# EAGLE design SwiftV2 (EAGLE 6.1)
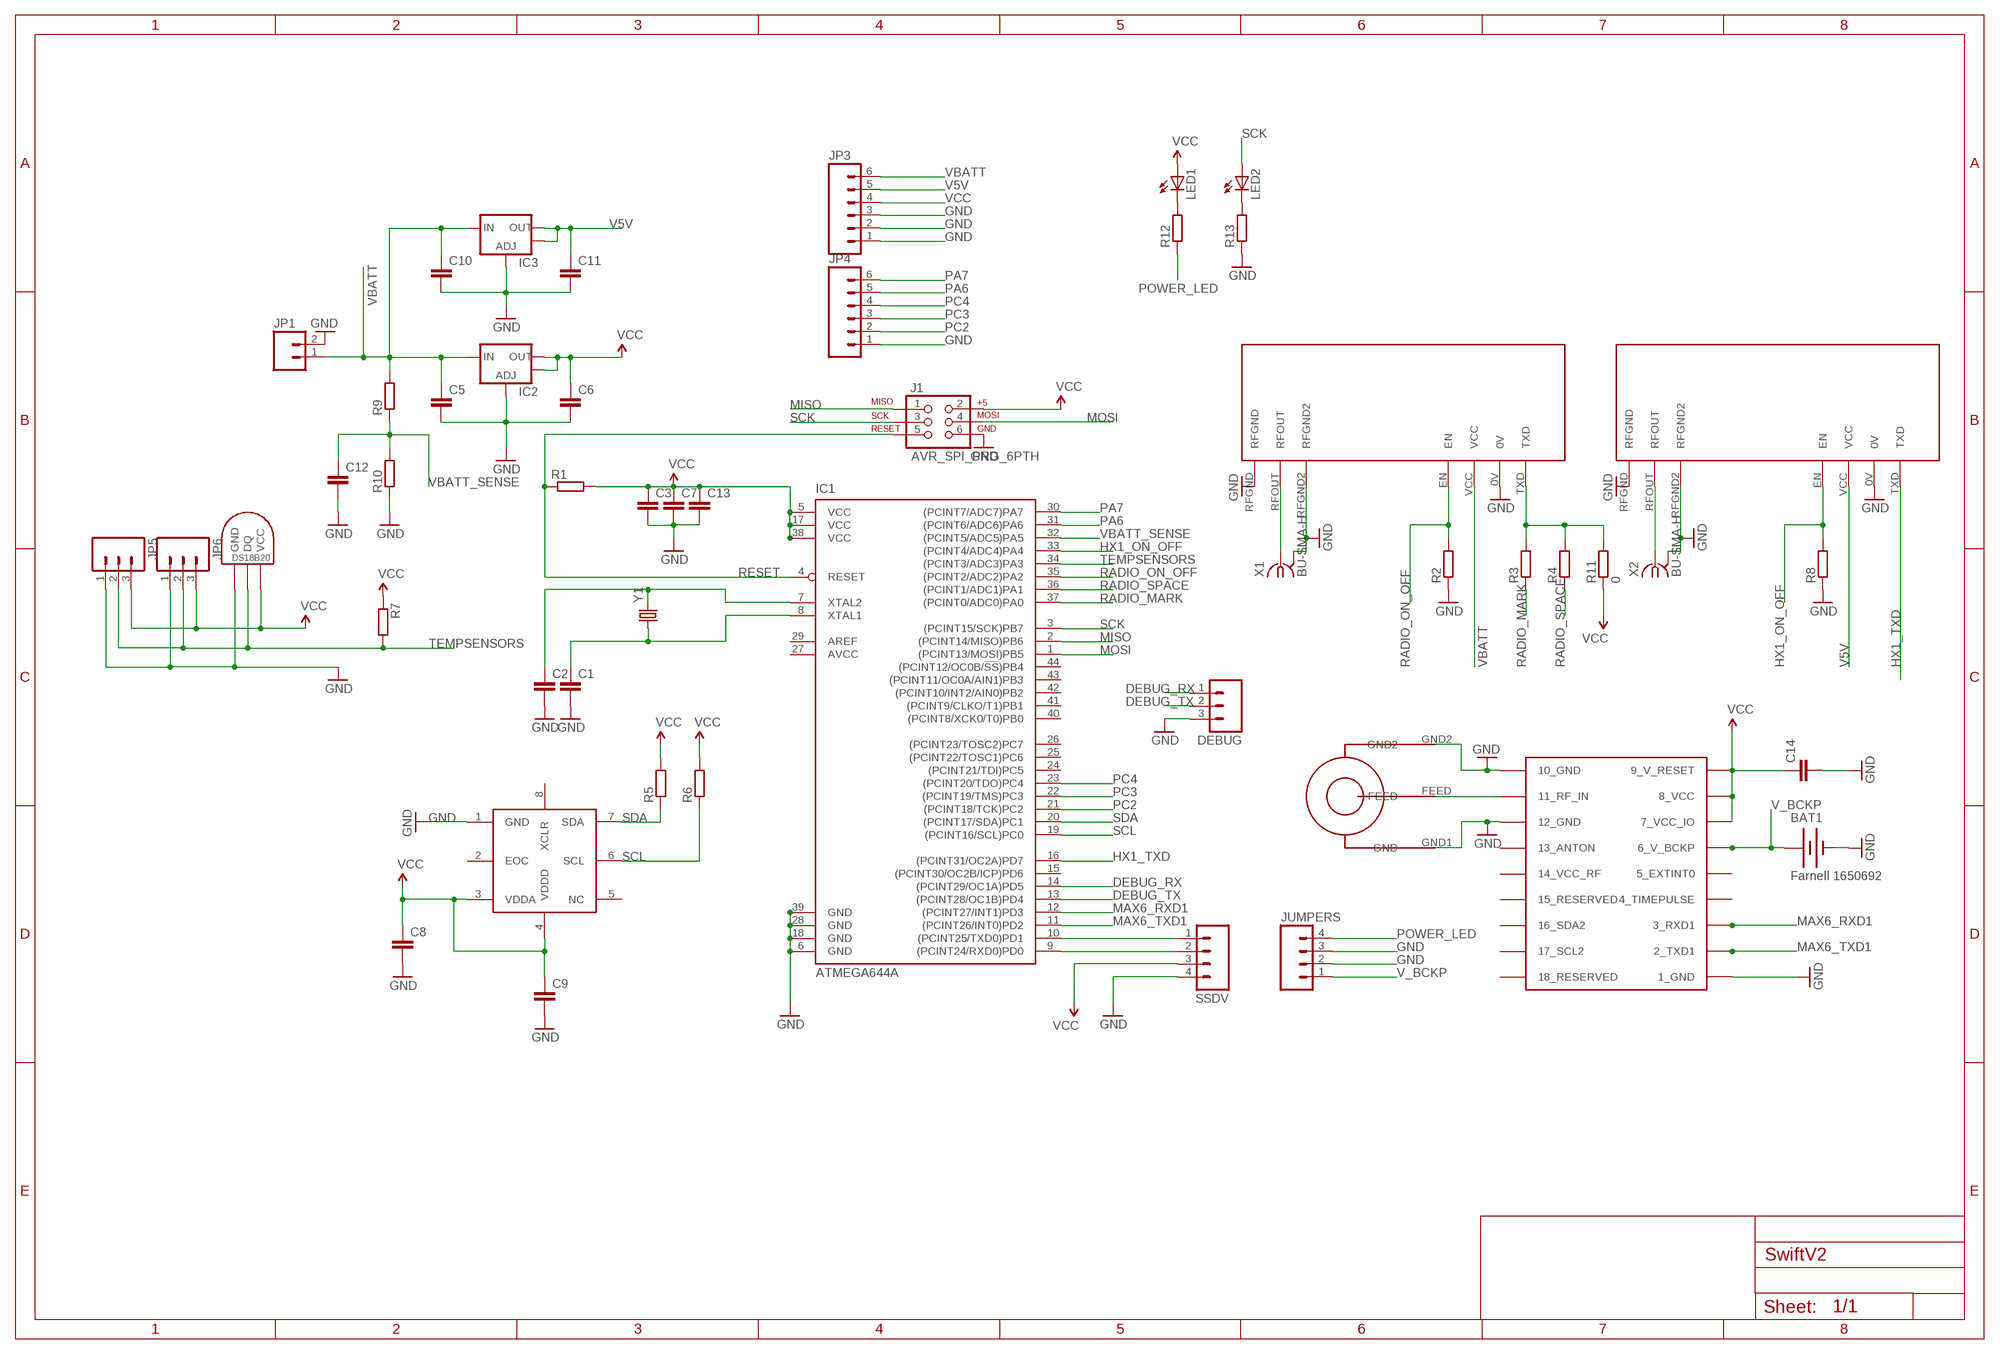
[diagram p0: schematic, sheet 1]

## Parts
BAT1  Farnell 1650692  BATTERY12MM  [BATTCON_12MM]
C1  C-EUC0805  [C0805]
C2  C-EUC0805  [C0805]
C3  C-EUC0805  [C0805]
C5  C-EUC0805  [C0805]
C6  C-EUC0805  [C0805]
C7  C-EUC0805  [C0805]
C8  C-EUC0805  [C0805]
C9  C-EUC0805  [C0805]
C10  C-EUC0805  [C0805]
C11  C-EUC0805  [C0805]
C12  C-EUC0805  [C0805]
C13  C-EUC0805  [C0805]
C14  C-EUC0805  [C0805]
DEBUG  M03PTH  [1X03]
IC1  ATMEGA644A  [TQFP44]
IC2  V_REG_LM1117SOT223  [SOT223]
IC3  V_REG_LM1117SOT223  [SOT223]
J1  AVR_SPI_PRG_6PTH  [2X3]
JP1  M02JST-PTH-2  [JST-2-PTH]
JP3  M06SIP  [1X06]
JP4  M06SIP  [1X06]
JP5  M03JST-PTH  [JST-3-PTH]
JP6  M03JST-PTH  [JST-3-PTH]
JUMPERS  M04PTH  [1X04]
LED1  LED0603  [LED-0603]
LED2  LED0603  [LED-0603]
R1  R-EU_R0805  [R0805]
R2  R-EU_R0805  [R0805]
R3  R-EU_R0805  [R0805]
R4  R-EU_R0805  [R0805]
R5  R-EU_R0805  [R0805]
R6  R-EU_R0805  [R0805]
R7  R-EU_R0805  [R0805]
R8  R-EU_R0805  [R0805]
R9  R-EU_R0805  [R0805]
R10  R-EU_R0805  [R0805]
R11  0  R-EU_R0805  [R0805]
R12  R-EU_R0805  [R0805]
R13  R-EU_R0805  [R0805]
SSDV  M04PTH  [1X04]
TEMPINT  DS1821  DS1820SOIC  [DS18B20_SOIC]
U$1  BMP085  [BMP085]
U$2  NTX2  [NTX2]
U$3  SARANTEL-SR1202  [SARANTEL-SR1202]
U$4  UBLOX_MAX-6  [UBLOX_MAX-6]
U$5  RADIOMETRIX-HX1  [RADIOMETRIX-HX1]
X1  BU-SMA-H  [BU-SMA-H]
X2  BU-SMA-H  [BU-SMA-H]
Y1  CRYSTALSMD  [HC49UP]

## Nets
DEBUG_RX: DEBUG.1 IC1.14((PCINT29/OC1A)PD5)
DEBUG_TX: DEBUG.2 IC1.13((PCINT28/OC1B)PD4)
GND: BAT1.GND(-) C1.2 C2.2 C3.2 C5.2 C6.2 C7.2 C8.2 C9.2 C10.2 C11.2 C12.2 C13.2 C14.2 DEBUG.3 IC1.6(GND) IC1.18(GND) IC1.28(GND) IC1.39(GND) IC2.1(ADJ) IC3.1(ADJ) J1.6 JP1.2 JP3.1 JP3.2 JP3.3 JP4.1 JP5.1 JP6.1 JUMPERS.2 JUMPERS.3 R2.1 R8.1 R10.1 R13.1 SSDV.4 TEMPINT.GND U$1.1(GND) U$2.0V U$2.RFGND U$2.RFGND2 U$3.GND1(GND) U$3.GND2 U$4.1_GND U$4.10_GND U$4.12_GND U$5.0V U$5.RFGND U$5.RFGND2 X1.2(GND) X2.2(GND)
HX1_ON_OFF: IC1.33((PCINT4/ADC4)PA4) R8.2 U$5.EN
HX1_TXD: IC1.16((PCINT31/OC2A)PD7) U$5.TXD
MAX6_RXD1: IC1.12((PCINT27/INT1)PD3) U$4.3_RXD1
MAX6_TXD1: IC1.11((PCINT26/INT0)PD2) U$4.2_TXD1
MISO: IC1.2((PCINT14/MISO)PB6) J1.1
MOSI: IC1.1((PCINT13/MOSI)PB5) J1.4
N$1: C2.1 IC1.7(XTAL2) Y1.2
N$2: C1.1 IC1.8(XTAL1) Y1.1
N$4: U$2.RFOUT X1.1
N$7: LED1.C R12.2
N$8: U$5.RFOUT X2.1
N$9: U$3.FEED U$4.11_RF_IN
N$10: R3.2 R4.2 R11.2 U$2.TXD
N$14: LED2.C R13.2
PA6: IC1.31((PCINT6/ADC6)PA6) JP4.5
PA7: IC1.30((PCINT7/ADC7)PA7) JP4.6
PC2: IC1.21((PCINT18/TCK)PC2) JP4.2
PC3: IC1.22((PCINT19/TMS)PC3) JP4.3
PC4: IC1.23((PCINT20/TDO)PC4) JP4.4
POWER_LED: JUMPERS.4 R12.1
RADIO_MARK: IC1.37((PCINT0/ADC0)PA0) R3.1
RADIO_ON_OFF: IC1.35((PCINT2/ADC2)PA2) R2.2 U$2.EN
RADIO_SPACE: IC1.36((PCINT1/ADC1)PA1) R4.1
RESET: IC1.4(RESET) J1.5 R1.1
RXD0: IC1.9((PCINT24/RXD0)PD0) SSDV.2
SCK: IC1.3((PCINT15/SCK)PB7) J1.3 LED2.A
SCL: IC1.19((PCINT16/SCL)PC0) R6.1 U$1.6(SCL)
SDA: IC1.20((PCINT17/SDA)PC1) R5.1 U$1.7(SDA)
TEMPSENSORS: IC1.34((PCINT3/ADC3)PA3) JP5.2 JP6.2 R7.2 TEMPINT.DQ
TXD0: IC1.10((PCINT25/TXD0)PD1) SSDV.1
V5V: C11.1 IC3.2(OUT) IC3.4(OUT) JP3.5 U$5.VCC
V_BCKP: BAT1.PWR@1(+) JUMPERS.1 U$4.6_V_BCKP
VBATT: C5.1 C10.1 IC2.3(IN) IC3.3(IN) JP1.1 JP3.6 R9.2 U$2.VCC
VBATT_SENSE: C12.1 IC1.32((PCINT5/ADC5)PA5) R9.1 R10.2
VCC: C3.1 C6.1 C7.1 C8.1 C9.1 C13.1 C14.1 IC1.5(VCC) IC1.17(VCC) IC1.38(VCC) IC2.2(OUT) IC2.4(OUT) J1.2 JP3.4 JP5.3 JP6.3 LED1.A R1.2 R5.2 R6.2 R7.1 R11.1 SSDV.3 TEMPINT.VCC U$1.3(VDDA) U$1.4(VDDD) U$4.7_VCC_IO U$4.8_VCC U$4.9_V_RESET
Unconnected: IC1.15((PCINT30/OC2B/ICP)PD6) IC1.24((PCINT21/TDI)PC5) IC1.25((PCINT22/TOSC1)PC6) IC1.26((PCINT23/TOSC2)PC7) IC1.29(AREF) IC1.40((PCINT8/XCK0/T0)PB0) IC1.41((PCINT9/CLKO/T1)PB1) IC1.42((PCINT10/INT2/AIN0)PB2) IC1.43((PCINT11/OC0A/AIN1)PB3) IC1.44((PCINT12/OC0B/!SS!)PB4) U$1.2(EOC) U$1.5(NC) U$1.8(XCLR) U$4.4_TIMEPULSE U$4.5_EXTINT0 U$4.13_ANTON U$4.14_VCC_RF U$4.15_RESERVED U$4.16_SDA2 U$4.17_SCL2 U$4.18_RESERVED

## Power pins joined to a net without a drawn wire
AVCC: IC1.27(AVCC)
GND: X1.3(GND) X1.4(GND) X1.5(GND) X2.3(GND) X2.4(GND) X2.5(GND)

## Library data of the parts
BAT1 = SparkFun:BATTERY: Battery Holders Various common sizes : AA, AAA, 20mm coin cell and 12mm coin cell.
C1-C3 C5-C14 = resistor:C-EU: CAPACITOR, European symbol
DEBUG JP5 JP6 = SparkFun:M03: Header 3 Standard 3-pin 0.1" header. Use with straight break away headers (SKU : PRT-00116), right angle break away headers (PRT-00553), swiss pins (PRT-00743), machine pins (PRT-00117), and female headers (PRT-00115). Molex polarized connector foot print use with SKU : PRT-08232 with associated crimp pins and housings.
IC1 = atmel:ATMEGA644: 8-bit Microcontroller with 64K Bytes In-System Programmable Flash Source: http://www.atmel.com/dyn/resources/prod_documents/doc2593.pdf; MPN: ATMEGA644PV-10AU; OC_FARNELL: 1455123; OC_NEWARK: 58M3748
IC2 IC3 = SparkFun:V_REG_LM1117: Voltage Regulator LM1117 Standard adjustable voltage regulator but in SMD form. Spark Fun Electronics SKU : COM-00595
J1 = SparkFun:AVR_SPI_PRG_6: AVR ISP 6 Pin This is the reduced ISP connector for AVR programming. Common on Arduino. This footprint will take up less PCB space and can be used with a 10-pin to 6-pin adapter such as SKU: BOB-08508
JP1 = SparkFun:M02: Header 2 Standard 2-pin 0.1" header. Use with straight break away headers (SKU : PRT-00116), right angle break away headers (PRT-00553), swiss pins (PRT-00743), machine pins (PRT-00117), and female headers (PRT-00115). Molex polarized connector foot print use with SKU : PRT-08233 with associated crimp pins and housings.
JP3 JP4 = SparkFun:M06: Header 6 Standard 6-pin 0.1" header. Use with straight break away headers (SKU : PRT-00116), right angle break away headers (PRT-00553), swiss pins (PRT-00743), machine pins (PRT-00117), and female headers (PRT-00115). Molex polarized connector foot print use with SKU : PRT-08094 with associated crimp pins and housings. NOTES ON THE VARIANTS LOCK and LOCK_LONGPADS... This footprint was designed to help hold the alignment of a through-hole component (i.e. 6-pin header) while soldering it into place. You may notice that each hole has been shifted either up or down by 0.005 of an inch from it's more standard position (which is a perfectly straight line). This slight alteration caused the pins (the squares in the middle) to touch the edges of the holes. Because they are alternating, it causes a "brace" to hold the component in place. 0.005 has proven to be the perfect amount of "off-center" position when using our standard breakaway headers. Although looks a little odd when you look at the bare footprint, once you have a header in there, the alteration is very hard to notice. Also, if you push a header all the way into place, it is covered up entirely on the bottom side. This idea of altering the position of holes to aid alignment will be further integrated into the Sparkfun Library for other footprints. It can help hold any component with 3 or more connection pins.
JUMPERS SSDV = SparkFun:M04: Header 4 Standard 4-pin 0.1" header. Use with straight break away headers (SKU : PRT-00116), right angle break away headers (PRT-00553), swiss pins (PRT-00743), machine pins (PRT-00117), and female headers (PRT-00115). Molex polarized connector foot print use with SKU : PRT-08231 with associated crimp pins and housings. 1MM SMD Version SKU: PRT-10208
LED1 LED2 = SparkFun:LED: LEDs Standard schematic elements and footprints for 5mm, 3mm, 1206, and 0603 sized LEDs. 5mm - Spark Fun Electronics SKU : COM-00529 (and others)
R1-R13 = resistor:R-EU_: RESISTOR, European symbol
TEMPINT = ava:DS1820: DS18B20 Programmable Resolution 1-Wire Digital Thermometer Description The DS18B20 digital thermometer provides 9-bit to 12-bit Celsius temperature measurements and has an alarm function with nonvolatile user-programmable upper and lower trigger points. The DS18B20 communicates over a 1-Wire® bus that by definition requires only one data line (and ground) for communication with a central microprocessor. It has an operating temperature range of -55°C to +125°C and is accurate to ±0.5°C over the range of -10°C to +85°C. In addition, the DS18B20 can derive power directly from the data line ("parasite power"), eliminating the need for an external power supply. Each DS18B20 has a unique 64-bit serial code, which allows multiple DS18B20s to function on the same 1-Wire bus. Thus, it is simple to use one microprocessor to control many DS18B20s distributed over a large area. Applications that can benefit from this feature include HVAC environmental controls, temperature monitoring systems inside buildings, equipment, or machinery, and process monitoring and control systems.
U$1 = SparkFun:BMP085
U$2 = ava:NTX2: Radiometrix NTX2 Transmitter Module Author Anthony Stirk / http://ava.upuaut.net
U$3 = ava:SARANTEL-SR1202: SARANTEL-SL1202 Author Anthony Stirk / http://ava.upuaut.net Data Sheet : http://docs-europe.electrocomponents.com/webdocs/0dbd/0900766b80dbde80.pdf
U$4 = ava:UBLOX_MAX-6: UBLOX MAX-6
U$5 = ava:RADIOMETRIX-HX1
X1 X2 = con-coax:BU-SMA-H: FEMALE SMA CONNECTOR Radiall; OC_FARNELL: unknown; OC_NEWARK: unknown
Y1 = SparkFun:CRYSTAL: Crystals Various standard crystals. Proven footprints. Spark Fun Electronics SKU : COM-00534

## Board
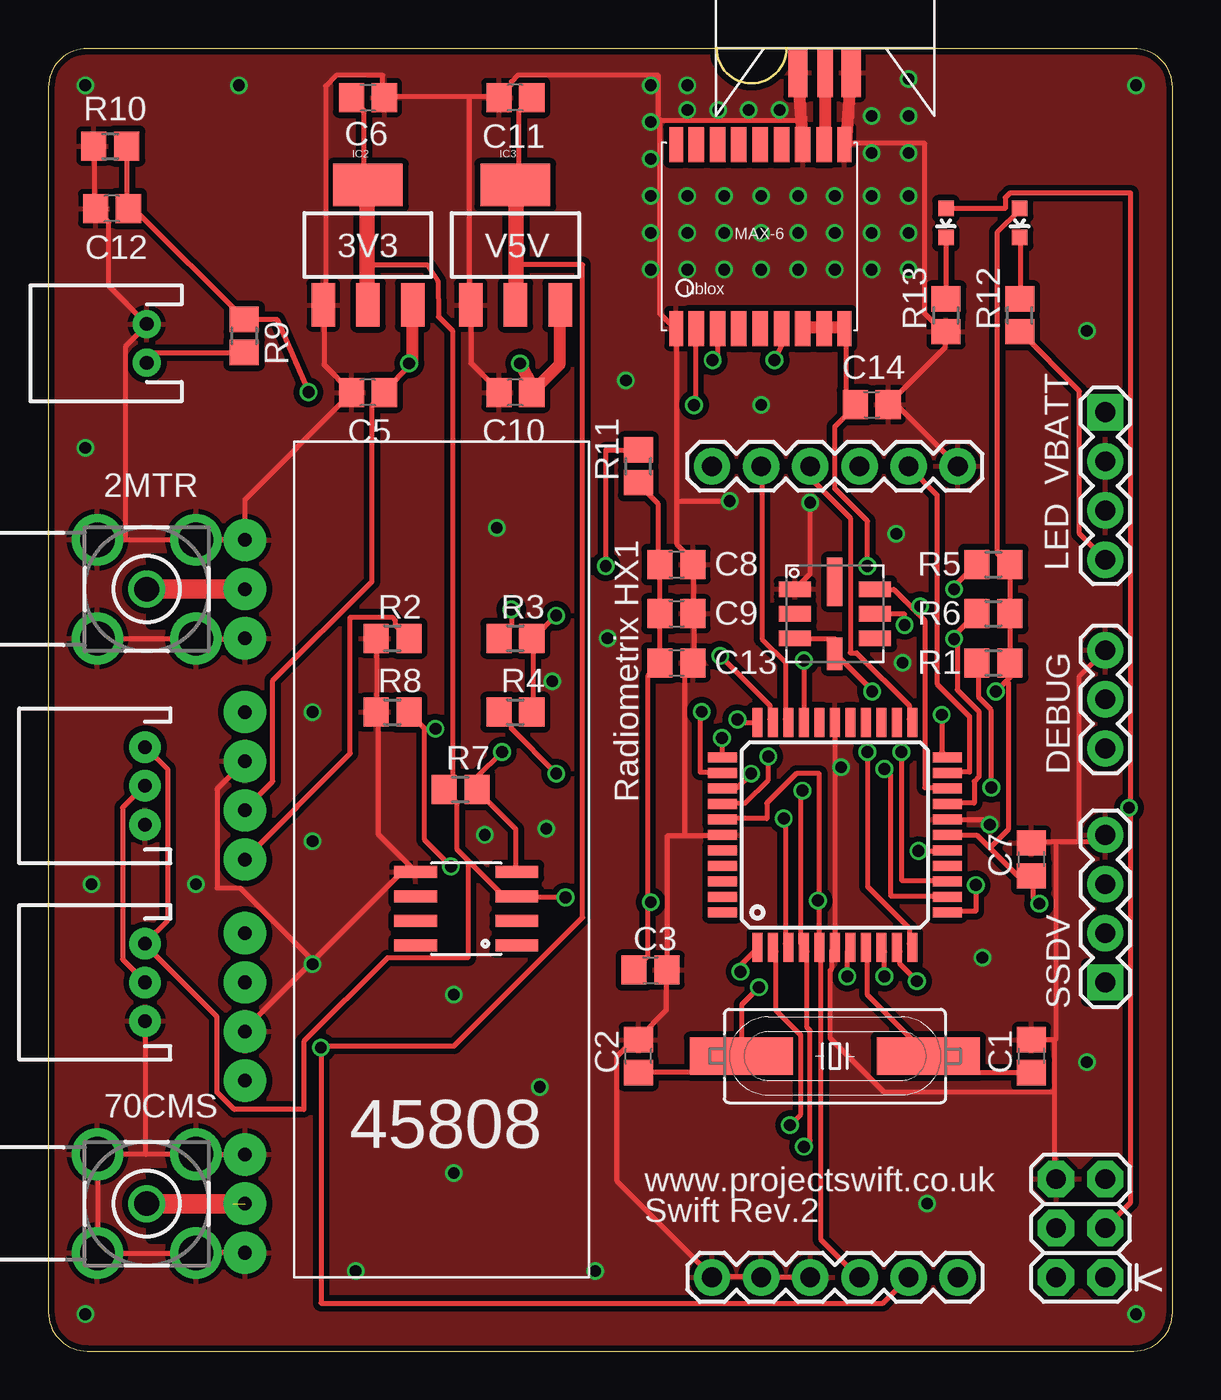
[diagram p1: board, top side]
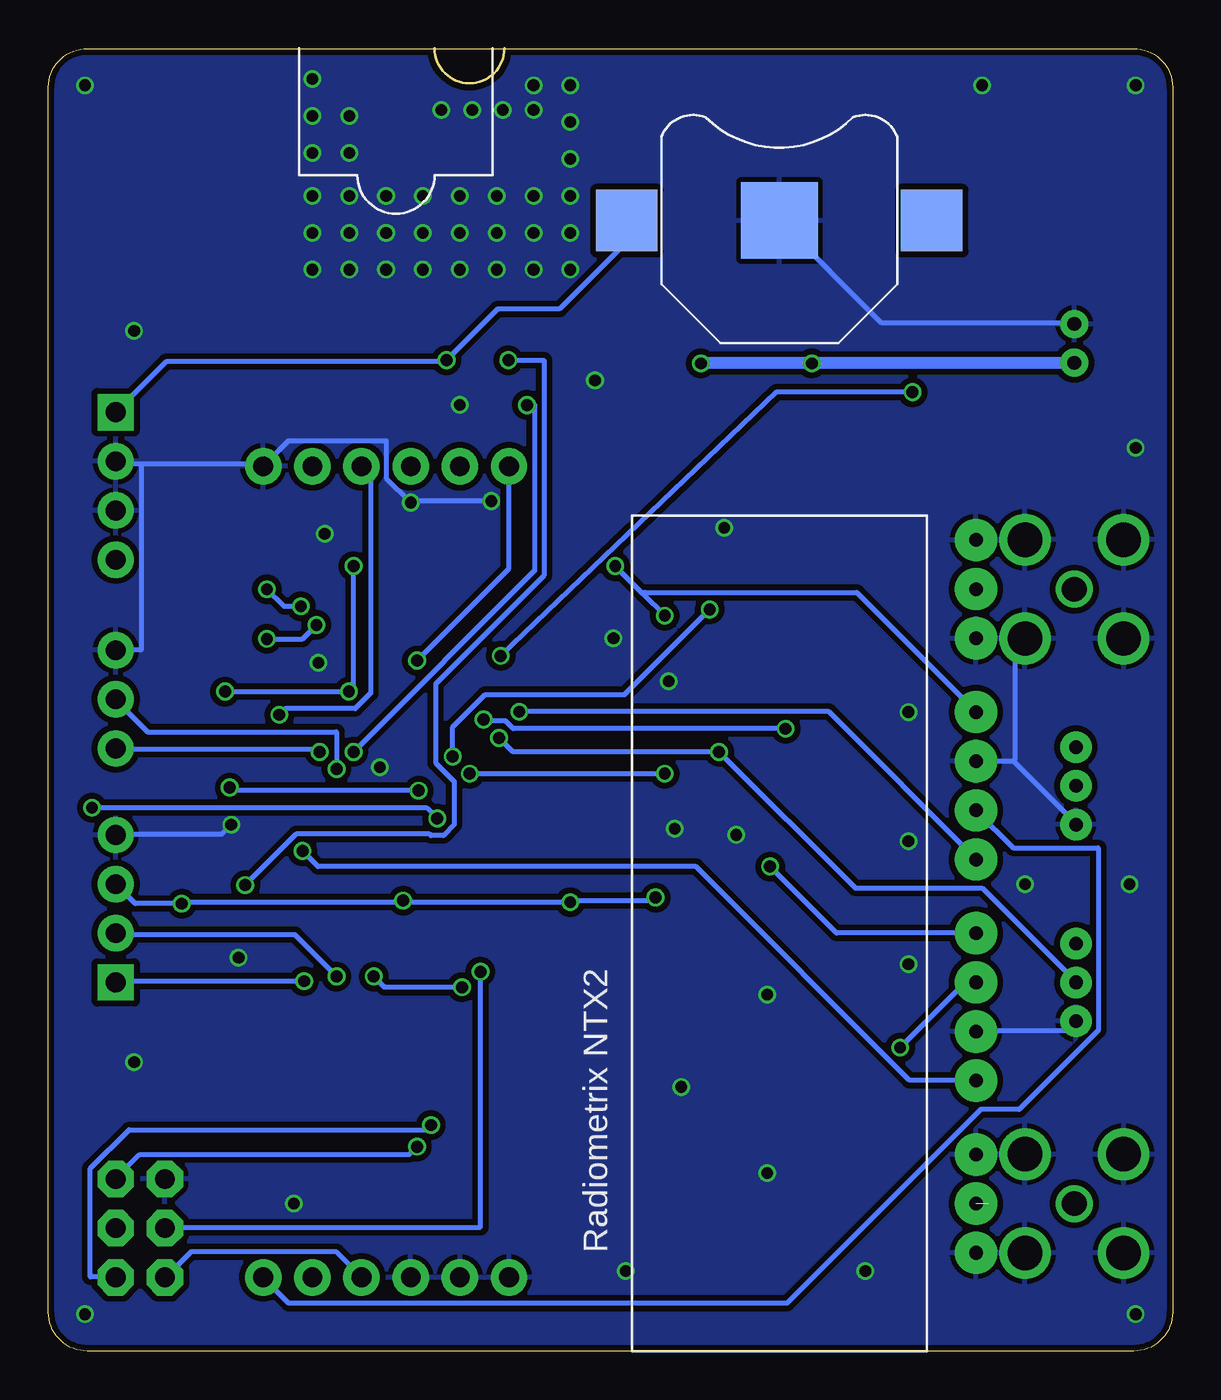
[diagram p2: board, bottom side, seen from below]

Size 58.09 x 67.31 mm. Coordinates in mm from the lower left corner, seen from the top.
Outline: 0,65.3 0,2 arc90 2,0 56.09,0 arc90 58.09,2 58.09,65.3 arc90 56.09,67.3 2,67.3 arc90 0,65.3
Copper layers (1*16): Top 0.035mm / dielectric 1.5mm / Bottom 0.035mm
Design rules: minimum track width 6mil, minimum drill 12mil, track to track 6mil, track to pad 6mil, pad to pad 6mil, via to via 6mil, smd to smd 0mil, copper to edge 10mil, drill to drill 10mil, minimum pad ring 10mil, minimum via ring 6mil, stop-mask expansion 2mil, vias tented up to drill 100mil, thermal gap 10mil
tRestrict: area 5.3,37.6 to 9.9,40.9; area 5.3,5.8 to 9.9,9.1

### Footprints (pad centres in the part's own frame; a part is rotated, then mirrored left to right if it is on the bottom)
BATTCON_12MM = smd 3.962 x 3.962: GND 0,0 | smd 3.175 x 3.175: PWR@1 -7.874,0; PWR@2 7.874,0
C0805 = smd 1.3 x 1.5: 1 -0.85,0; 2 0.85,0
1X03 = drill 1.016 pad 1.88: 1 0,0; 2 2.54,0; 3 5.08,0
TQFP44 = smd 1.5 x 0.5: 1 -5.8,4; 2 -5.8,3.2; 3 -5.8,2.4; 4 -5.8,1.6; 5 -5.8,0.8; 6 -5.8,0; 7 -5.8,-0.8; 8 -5.8,-1.6; 9 -5.8,-2.4; 10 -5.8,-3.2; 11 -5.8,-4; 23 5.8,-4; 24 5.8,-3.2; 25 5.8,-2.4; 26 5.8,-1.6; 27 5.8,-0.8; 28 5.8,0; 29 5.8,0.8; 30 5.8,1.6; 31 5.8,2.4; 32 5.8,3.2; 33 5.8,4 | smd 0.5 x 1.5: 12 -4,-5.8; 13 -3.2,-5.8; 14 -2.4,-5.8; 15 -1.6,-5.8; 16 -0.8,-5.8; 17 0,-5.8; 18 0.8,-5.8; 19 1.6,-5.8; 20 2.4,-5.8; 21 3.2,-5.8; 22 4,-5.8; 34 4,5.8; 35 3.2,5.8; 36 2.4,5.8; 37 1.6,5.8; 38 0.8,5.8; 39 0,5.8; 40 -0.8,5.8; 41 -1.6,5.8; 42 -2.4,5.8; 43 -3.2,5.8; 44 -4,5.8
SOT223 = smd 1.219 x 2.235: 1 -2.311,-3.099; 2 0,-3.099; 3 2.311,-3.099 | smd 3.6 x 2.2: 4 0,3.099
2X3 = drill 1.016 pad 1.88 octagon: 1 0,0; 2 0,2.54; 3 2.54,0; 4 2.54,2.54; 5 5.08,0; 6 5.08,2.54
JST-2-PTH = drill 0.7 pad 1.448: 1 -1,0; 2 1,0
1X06 = drill 1.016 pad 1.88: 1 0,0; 2 2.54,0; 3 5.08,0; 4 7.62,0; 5 10.16,0; 6 12.7,0
JST-3-PTH = drill 0.7 pad 1.626: 1 -2,-5; 2 0,-5; 3 2,-5
1X04 = drill 1.016 pad 1.88 square: 1 0,0 | drill 1.016 pad 1.88: 2 2.54,0; 3 5.08,0; 4 7.62,0
LED-0603 = smd 0.8 x 0.8: A 0,-0.75; C 0,0.75
R0805 = smd 1.3 x 1.5: 1 -0.85,0; 2 0.85,0
DS18B20_SOIC = smd 0.61 x 2.21: DQ 1.905,-2.616; GND 1.905,2.616; NC -1.905,-2.616; NC2 -0.635,-2.616; NC3 -1.905,2.616; NC4 -0.635,2.616; NC5 0.635,2.616; VCC 0.635,-2.616
BMP085 = smd 1.67 x 0.8: 1 -2.065,1.27; 2 -2.065,0; 3 -2.065,-1.27; 5 2.065,-1.27; 6 2.065,0; 7 2.065,1.27 | smd 0.8 x 1.67: 4 0,-2.065 | smd 0.8 x 2.5: 8 0,1.65
NTX2 = drill 0.7 pad 2.184: 0V -2.54,-10.16; EN -7.62,-10.16; RFGND -22.86,-10.16; RFGND2 -27.94,-10.16; RFOUT -25.4,-10.16; TXD 0,-10.16; VCC -5.08,-10.16
SARANTEL-SR1202 = smd 2.5 x 0.8: FEED 0,0 | smd 2.5 x 1: GND1 0,1.4; GND2 0,-1.35
UBLOX_MAX-6 = smd 1.8 x 0.7: 1_GND 4.95,-4.4; 9_V_RESET 4.95,4.3; 10_GND -4.55,4.3; 18_RESERVED -4.55,-4.4 | smd 1.8 x 0.8: 2_TXD1 4.95,-3.35; 3_RXD1 4.95,-2.25; 4_TIMEPULSE 4.95,-1.15; 5_EXTINT0 4.95,-0.05; 6_V_BCKP 4.95,1.05; 7_VCC_IO 4.95,2.15; 8_VCC 4.95,3.25; 11_RF_IN -4.55,3.25; 12_GND -4.55,2.15; 13_ANTON -4.55,1.05; 14_VCC_RF -4.55,-0.05; 15_RESERVED -4.55,-1.15; 16_SDA2 -4.55,-2.25; 17_SCL2 -4.55,-3.35
RADIOMETRIX-HX1 = drill 0.7 pad 2.184: 0V 8.89,-10.16; EN 3.81,-10.16; RFGND -11.43,-10.16; RFGND2 -16.51,-10.16; RFOUT -13.97,-10.16; TXD 11.43,-10.16; VCC 6.35,-10.16
BU-SMA-H = drill 1.27: 1 0,0 | drill 1.778: 2 -2.55,2.55; 3 2.55,2.55; 4 2.55,-2.55; 5 -2.55,-2.55
HC49UP = smd 5.334 x 1.93: 1 -4.826,0; 2 4.826,0

### Placement (x,y rotation side)
BAT1  20.32,58.42 0 bottom
C1  50.8,15.24 90 top
C2  30.48,15.24 90 top
C3  31.11,19.68 0 top
C5  16.51,49.53 180 top
C6  16.51,64.77 0 top
C7  50.8,25.4 90 top
C8  32.45,40.64 0 top
C9  32.45,38.1 0 top
C10  24.13,49.53 180 top
C11  24.13,64.77 180 top
C12  3.29,59.03 180 top
C13  32.45,35.56 0 top
C14  42.55,48.9 0 top
DEBUG  54.61,31.14 90 top
IC1  40.64,26.67 90 top
IC2  16.51,57.15 0 top
IC3  24.13,57.15 0 top
J1  54.61,3.81 90 top
JP1  5.08,52.07 90 top
JP3  34.29,3.81 0 top
JP4  46.99,45.72 180 top
JP5  0,29.21 90 top
JP6  0,19.05 90 top
JUMPERS  54.61,48.51 270 top
LED1  50.19,58.28 180 top
LED2  46.38,58.28 180 top
R1  48.83,35.56 0 top
R2  17.78,36.83 0 top
R3  24.13,36.83 0 top
R4  24.13,33.02 0 top
R5  48.83,40.64 0 top
R6  48.83,38.1 0 top
R7  21.29,29.03 0 top
R8  17.78,33.02 0 top
R9  10.12,52.46 270 top
R10  3.2,62.26 0 top
R11  30.48,45.72 90 top
R12  50.19,53.52 90 top
R13  46.38,53.52 90 top
SSDV  54.61,19.05 90 top
TEMPINT  21.59,22.86 90 top
U$1  40.64,38.1 0 top
U$2  20.32,33.02 90 bottom
U$3  40.13,66.04 90 top
U$4  36.83,57.78 270 top
U$5  20.32,25.4 270 top
X1  5.08,7.62 180 top
X2  5.08,39.37 180 top
Y1  40.64,15.24 180 top

### Tracks (layer width: path | path; a pad name or v marks a point on that pad's centre or on a via)
DEBUG_RX  (via drill 0.61)
  Top 0.254: v44.08,30.96 44.08,24.32 46.4,24.32 IC1.14
  Bottom 0.254: v44.08,30.96 44.24,31.12 54.56,31.12 DEBUG.1
DEBUG_TX  (via drill 0.61)
  Top 0.254: v43.2,30.08 43.52,29.76 43.52,23.52 46.4,23.52 IC1.13
  Bottom 0.254: v43.2,30.08 43.2,32 52.96,32 54.56,33.6 DEBUG.2
GND  (via drill 0.6, 0.61)
  Top 0.254: U$2.RFGND2 10.16,5.12 7.68,5.12 X1.2 7.52,5.04 2.56,5.04 X1.3 2.56,5.12 2.56,10.08 X1.4 2.56,10.16 5.04,10.16 | R2.1 16.96,36.8 16.96,33.04 R8.1 17.04,32.96 17.04,26.72 18.96,24.8 TEMPINT.GND 18.56,25.04 13.68,20.16 | U$2.RFGND 7.68,10.16 X1.5 7.52,10.16 5.04,10.16 | 5.04,10.16 5.04,17.04 JP6.1 | 13.68,20.16 10.16,16.64 U$5.0V | R10.1 2.4,62.24 2.4,59.04 C12.2 2.48,58.96 3.12,58.32 3.12,55.04 5.04,53.12 JP1.2 5.04,52.96 4,51.92 4,41.92 | U$5.RFGND 10.16,36.8 7.68,36.8 X2.2 7.52,36.8 2.56,36.8 X2.3 | 2.64,41.92 4,41.92 | 4,41.92 7.52,41.92 X2.5 7.68,41.92 10.08,41.92 U$5.RFGND2 10.16,44 15.6,49.44 C5.2 15.6,49.6 14.24,50.96 14.24,54 IC2.1 14.24,54.16 14.32,54.24 14.32,65.36 14.88,65.92 17.28,65.92 17.28,64.88 C6.2 17.36,64.8 21.76,64.8 | 13.68,20.16 9.92,23.92 8.72,23.92 8.72,29.04 U$2.0V | 41.23,62.42 41.52,62.4 45.28,62.4 45.28,53.6 46.24,52.64 R13.1 46.32,52.64 46.32,51.84 43.44,48.96 C14.2 43.68,49.04 46.96,45.76 JP4.1 | v39.36,43.84 39.36,40.16 38.64,39.44 U$1.1 | v48.64,27.2 48.64,27.44 46.48,27.44 IC1.18 | 53.28,26.32 54.56,26.32 54.56,26.64 SSDV.4 | 53.28,26.32 52.08,26.32 | 52.08,26.32 50.8,26.32 C7.2 | 53.28,26.32 53.28,34.88 54.56,36.16 DEBUG.3 | IC1.28 IC1.6 40.56,20.8 40.48,20.72 40.48,19.76 40.4,19.68 40.4,16.16 43.2,13.36 52,13.36 | 52,16.08 C1.2 | 52,13.36 52,8.96 J1.6 | 52,13.36 52,16.08 | 52.08,26.32 52.08,16.16 52,16.08 | JP3.3 39.36,3.84 36.88,3.84 JP3.2 36.8,3.84 34.32,3.84 JP3.1 34.24,3.92 29.36,8.8 29.36,15.2 30.4,16.24 C2.2 30.48,16.16 31.92,17.6 31.92,19.68 C3.2 32,19.76 32,26.64 32.88,26.64 | 32.88,26.64 34.8,26.64 IC1.39
  Top 0.254: 21.76,64.8 23.28,64.8 C11.2 23.36,64.88 23.92,65.44 23.92,65.6 24.24,65.92 31.52,65.92 31.52,63.68 31.6,63.6 | C10.2 23.28,49.6 21.84,51.04 21.84,54 IC3.1 21.76,54.16 21.76,64.8 | 32.48,43.92 32.48,41.68 33.28,40.88 33.28,40.72 C8.2 33.36,40.64 33.36,38.16 C9.2 33.36,38.08 33.36,35.6 C13.2 33.28,35.44 32.88,35.04 32.88,26.64 | 32.48,43.92 32.48,52.8 U$4.1_GND 32.32,52.88 31.6,53.6 31.6,63.6 | 31.6,63.6 38.64,63.6 38.89,63.62 | 32.48,43.92 v35.2,43.92
  Top 0.406: U$4.10_GND 41.23,62.34 | U$3.GND1 38.73,65.79
  Top 0.61: 41.23,62.34 41.23,62.42 U$3.GND2 | 38.73,65.79 38.89,63.62 U$4.12_GND
  Bottom 0.254: JP6.1 5.04,17.04 5.52,16.56 10.16,16.56 U$5.0V | BAT1.GND 20.32,58.4 15.04,53.12 5.12,53.12 JP1.2 | 8.24,30.48 5.04,27.28 JP5.1 | U$2.0V 8.24,30.48 | 8.24,30.48 8.16,30.56 8.16,36.8 7.68,36.8 X2.2 | 53.28,45.84 47.04,45.84 JP4.1 46.96,45.76 45.68,47.04 40.64,47.04 40.64,45.12 v39.36,43.84 39.28,43.92 v35.2,43.92 | 53.28,45.84 54.48,45.84 54.56,45.92 JUMPERS.2 | v48.64,27.2 49.12,26.72 54.56,26.72 SSDV.4 | 53.28,45.84 53.28,36.24 54.56,36.24 DEBUG.3
  other vias: 43.81,42.23 44.13,35.56 13.65,33.02 28.89,36.83 13.65,26.35 13.65,20 7.62,24.13 22.54,26.67 25.72,26.99 20.95,18.41 26.04,34.61 53.66,52.7 48.26,20.32 40.96,30.16 36.83,57.78 36.83,59.69 36.83,55.88 31.11,63.5 31.11,65.41 31.11,61.59 33.02,65.41 31.11,57.78 31.11,59.69 31.11,55.88 33.02,57.78 33.02,59.69 33.02,55.88 34.92,57.78 34.92,59.69 34.92,55.88 38.73,57.78 38.73,59.69 38.73,55.88 40.64,57.78 40.64,59.69 40.64,55.88 42.55,57.78 42.55,59.69 42.55,55.88 44.45,57.78 44.45,59.69 44.45,55.88 42.55,61.91 42.55,63.82 44.45,61.91 44.45,65.72 56.2,65.41 1.91,65.41 1.91,46.67 9.84,65.41 1.91,1.91 56.2,1.91 45.4,7.62 15.88,4.13 20.95,9.21 25.4,13.65 28.26,4.13 23.18,42.55 29.84,50.16 53.66,14.92 2.22,24.13 44.45,63.82 37.78,64.14 36.2,64.14 34.61,64.14 33.02,64.14 36.83,48.9
  pour Bottom (isolate 0.305): 0,67.31 58.1,67.31 58.1,-0.32 0,-0.32
  pour Top (isolate 0.305): 0,-0.32 0,67.31 58.1,67.31 58.1,-0.32
HX1_ON_OFF  (via drill 0.61)
  Top 0.254: 19.44,32.16 18.64,32.96 R8.2 | 19.44,32.16 19.44,26.4 v20.8,25.04 | v35.6,32.64 35.6,32.48 IC1.33 | 19.44,32.16 v20,32.16
  Bottom 0.254: v20.8,25.04 17.36,21.6 U$5.EN | v35.6,32.64 35.52,32.56 34.48,32.56 34.08,32.16 v20,32.16
HX1_TXD  (via drill 0.61)
  Top 0.254: v44.96,25.84 46.4,25.84 IC1.16
  Bottom 0.254: v44.96,25.84 44.16,25.04 24.64,25.04 13.6,14 10.16,14 U$5.TXD
MAX6_RXD1  (via drill 0.61)
  Top 0.254: v47.92,24.08 47.92,22.72 46.48,22.72 IC1.12 | v34.32,51.2 34.56,51.44 34.56,52.8 U$4.3_RXD1
  Bottom 0.254: v47.92,24.08 45.28,26.72 38.4,26.72 38.32,26.64 37.68,26.64 37.12,27.2 37.12,29.44 38.08,30.4 38.08,34.48 32.48,40.08 32.48,51.2 v34.32,51.2
MAX6_TXD1  (via drill 0.61)
  Top 0.254: v42.32,30.96 42.32,24 44.48,21.84 44.48,21.04 IC1.11 | v33.36,48.88 33.44,48.96 33.44,52.8 U$4.2_TXD1
  Bottom 0.254: v42.32,30.96 32.96,40.32 32.96,48.88 v33.36,48.88
MISO  (via drill 0.61)
  Top 0.254: v38.32,11.68 38.88,12.24 38.88,16.32 37.6,17.6 37.6,20.64 37.44,20.8 IC1.2
  Bottom 0.254: v38.32,11.68 38.56,11.44 53.92,11.44 55.92,9.44 55.92,3.84 54.64,3.84 J1.1
MOSI  (via drill 0.61)
  Top 0.254: v35.76,19.6 35.76,19.92 36.64,20.8 IC1.1
  Bottom 0.254: v35.76,19.6 35.76,6.4 52,6.4 J1.4
N$1  (via drill 0.61)
  Top 0.254: C2.1 35.76,14.4 35.76,15.2 Y1.2 35.84,15.36 35.84,17.92 v36.72,18.8 | v41.28,19.36 41.28,20.64 41.44,20.8 IC1.7
  Bottom 0.254: v41.28,19.36 40.72,18.8 v36.72,18.8
N$2
  Top 0.254: IC1.8 42.24,20.8 42.32,20.72 42.32,18.4 45.44,15.28 Y1.1 45.44,15.12 45.44,14.4 C1.1
N$4  (1 unrouted)
  Top 1.016: X1.1 9.53,7.62
  Bottom 0.254: 10.16,7.6 U$2.RFOUT | 5.12,7.6 X1.1
N$7
  Top 0.254: LED1.C 50.24,57.52 50.24,54.4 R12.2
N$8
  Top 1.016: X2.1 U$5.RFOUT
N$9
  Top 0.254: U$4.11_RF_IN 40.08,62.4 40.13,62.48
  Top 0.61: U$3.FEED 40.13,62.48
N$10  (via drill 0.61)
  Top 0.254: R4.2 25.04,33.04 25.04,36.8 R3.2 25.12,36.88 v26.24,38 | v28.8,40.56 28.8,46.56 R11.2
  Bottom 0.254: v26.24,38 27.36,39.12 | 27.36,39.12 v28.8,40.56 | U$2.TXD 10.16,33.04 16.32,39.2 27.28,39.2 27.36,39.12
N$14
  Top 0.254: LED2.C 46.4,57.52 46.4,54.4 R13.2
PA6
  Top 0.254: IC1.31 38.08,32.64 38.08,35.6 36.88,36.8 36.88,45.68 JP4.5
PA7  (via drill 0.61)
  Top 0.254: v39.04,35.68 IC1.30
  Bottom 0.254: v39.04,35.68 34.32,40.4 34.32,45.68 JP4.6
PC2
  Top 0.254: IC1.21 46.48,29.92 47.6,29.92 47.6,32.8 45.92,34.48 45.92,44.24 44.48,45.68 JP4.2
PC3  (via drill 0.61)
  Top 0.254: v46.16,32.88 46.16,30.96 46.4,30.72 IC1.22
  Bottom 0.254: v46.16,32.88 45.84,33.2 42.24,33.2 41.44,34 41.44,45.68 41.84,45.68 JP4.3
PC4
  Top 0.254: IC1.23 44.48,32.64 44.48,33.36 41.76,36.08 41.44,36.08 41.44,43.04 39.44,45.04 39.44,45.68 JP4.4
POWER_LED
  Top 0.254: R12.1 50.24,52.64 53.28,49.6 53.28,42.24 54.56,40.96 JUMPERS.4
RADIO_MARK  (via drill 0.61)
  Top 0.254: v23.92,38.32 23.92,37.52 23.28,36.88 R3.1 | v37.2,30.72 37.2,29.52 36,28.32 34.88,28.32 IC1.37
  Bottom 0.254: v23.92,38.32 28.32,33.92 35.52,33.92 37.2,32.24 v37.2,30.72
RADIO_ON_OFF  (via drill 0.61)
  Top 0.254: R2.2 18.56,36.88 17.92,37.52 17.92,37.76 17.76,37.92 15.6,37.92 15.6,30.88 10.16,25.44 U$2.EN | v33.76,33.04 33.68,32.96 33.68,29.92 34.8,29.92 IC1.35
  Bottom 0.254: v33.76,33.04 17.76,33.04 10.16,25.44 U$2.EN
RADIO_SPACE  (via drill 0.61)
  Top 0.254: v26.24,29.84 23.92,32.16 23.92,32.32 23.28,32.96 R4.1 | v36.32,29.84 35.6,29.12 34.88,29.12 IC1.36
  Bottom 0.254: v36.32,29.84 v26.24,29.84
RESET  (via drill 0.61)
  Top 0.254: v39.04,10.56 39.36,10.88 39.36,16.56 39.2,16.72 39.2,20.64 39.04,20.8 IC1.4 38.96,20.96 38.88,21.04 38.88,28.88 v38.96,28.96 | v48.72,29.12 48.72,33.12 48.08,33.76 48.08,35.44 48,35.52 R1.1
  Bottom 0.254: v39.04,10.56 39.44,10.16 53.36,10.16 54.56,8.96 J1.5 | v48.72,29.12 48.56,28.96 v38.96,28.96
RXD0  (via drill 0.61)
  Top 0.254: v43.2,19.36 43.2,20.64 43.04,20.8 IC1.9
  Bottom 0.254: v43.2,19.36 45.36,21.52 54.56,21.52 SSDV.2
SCK  (via drill 0.61)
  Top 0.254: 55.92,28.08 55.92,7.68 54.64,6.4 J1.3 | 55.92,28.08 55.92,59.84 49.68,59.84 49.44,59.6 49.44,59.04 46.4,59.04 LED2.A | v38,27.52 38.08,27.44 38.08,21.04 IC1.3 | v55.84,28.08 55.92,28.08
  Bottom 0.254: v38,27.52 38.56,28.08 v55.84,28.08
SCL  (via drill 0.61)
  Top 0.254: 46.96,36.8 46.96,37.12 47.92,38.08 R6.1 | 46.96,36.8 46.96,34.16 48.08,33.04 48.08,29.68 47.84,29.44 47.84,28.32 46.48,28.32 IC1.19 | v44.24,37.52 44.24,38.08 42.72,38.08 U$1.6 | v46.8,36.8 46.96,36.8
  Bottom 0.254: v44.24,37.52 44.96,36.8 v46.8,36.8
SDA  (via drill 0.61)
  Top 0.254: 44.8,38.24 43.68,39.36 42.72,39.36 U$1.7 | 44.8,38.24 45.28,37.76 45.28,29.12 46.4,29.12 IC1.20 | v46.8,39.36 46.8,39.52 47.92,40.64 R5.1 | 44.8,38.24 v45.04,38.48
  Bottom 0.254: v46.8,39.36 45.92,38.48 v45.04,38.48
TEMPSENSORS  (via drill 0.61)
  Top 0.254: JP6.2 4.96,19.12 3.84,20.24 3.84,28.08 4.96,29.2 JP5.2 | TEMPINT.DQ 24.16,24.8 24.16,26.96 22.16,28.96 R7.2 22.16,29.12 22.16,29.68 v23.44,30.96 | v34.8,31.68 34.8,30.72 IC1.34
  Bottom 0.254: v34.8,31.68 34.08,30.96 v23.44,30.96 16.4,23.92 9.84,23.92 5.04,19.12 JP6.2
TXD0  (via drill 0.61)
  Top 0.254: v44.88,19.12 44,20 44,20.64 43.84,20.8 IC1.10
  Bottom 0.254: v44.88,19.12 54.56,19.12 SSDV.1
V5V  (via drill 0.61)
  Top 0.254: C11.1 24.96,64.72 24.32,64.08 24.32,60.48 24.16,60.32 IC3.4 24.16,60.16 | 24.16,54.08 IC3.2 | JP3.5 43.12,2.48 14.08,2.48 v14.08,15.68 14.16,15.76 20.96,15.76 27.6,22.4 27.6,56.13 24.16,56.13
  Top 0.813: 24.16,60.16 24.16,56.13 24.16,54.08
  Bottom 0.254: v14.08,15.68 10.72,19.04 U$5.VCC
V_BCKP  (via drill 0.61)
  Top 0.254: v37.52,51.2 38.13,52.48 37.84,52.8 U$4.6_V_BCKP
  Bottom 0.254: BAT1.PWR@1 28.24,58.4 28.24,57.28 31.68,53.84 34.88,53.84 v37.52,51.2 37.6,51.12 52,51.12 54.56,48.56 JUMPERS.1
VBATT  (via drill 0.61)
  Top 0.254: 25.04,49.6 C10.1 25.04,49.76 | 26.4,54 IC3.3 | R9.2 10.08,51.6 5.12,51.6 5.12,51.12 JP1.1 | 18.8,51.04 18.72,50.96 | 18.72,50.96 17.36,49.6 C5.1 17.28,49.44 16.72,48.88 16.72,39.76 11.6,34.64 11.6,29.44 10.16,28 U$2.VCC | 18.8,54 IC2.3 | v18.64,51.04 18.72,50.96
  Top 0.61: 25.04,49.6 26.4,50.96 26.4,54 | v24.37,51.04 25.04,49.76 | 18.8,54 18.8,51.04
  Bottom 0.254: 5.12,51.04 JP1.1 | JP3.6 46.96,3.76 45.68,2.48 19.92,2.48 9.92,12.48 7.92,12.48 3.84,16.56 3.84,26 8.24,26 10.16,27.92 U$2.VCC
  Bottom 0.61: 5.12,51.04 v18.64,51.04 v24.37,51.04
VBATT_SENSE  (via drill 0.61)
  Top 0.254: R10.2 4.08,62.24 4.08,59.12 C12.1 4.16,58.96 4.48,58.96 10.08,53.36 R9.1 11.82,53.31 v13.44,49.55 | v34.72,35.92 37.28,33.36 37.28,32.64 IC1.32
  Bottom 0.254: v34.72,35.92 20.48,49.55 v13.44,49.55
VCC  (via drill 0.61)
  Top 0.254: JP5.3 5.04,31.2 6.16,30.08 6.16,22.24 5.04,21.12 JP6.3 5.04,20.96 8.72,17.28 8.72,13.36 9.6,12.48 13.2,12.48 13.2,16 17.52,20.32 21.68,20.32 21.68,25.2 21.76,25.28 | 21.76,25.28 23.52,23.52 24.16,23.52 TEMPINT.VCC 24.32,23.44 v26.72,23.44 | 21.76,25.28 21.12,25.92 21.12,28.32 20.48,28.96 R7.1 20.48,29.12 20.88,29.52 20.88,52.72 20.16,53.44 20.14,55.28 19.58,56.13 16.48,56.13 | C6.1 15.68,64.72 16.32,64.08 16.32,60.48 16.48,60.32 IC2.4 16.48,60.16 | 16.48,54.08 IC2.2 | JP3.4 41.84,3.84 39.92,5.76 39.92,20.72 39.84,20.8 IC1.5 39.84,23.28 | 39.84,23.28 39.84,29.84 38.64,29.84 37.12,28.32 37.12,27.52 34.88,27.52 IC1.38 | 30.96,23.2 30.96,34.88 31.6,35.52 C13.1 31.6,35.68 31.6,38.08 C9.1 31.6,38.16 C8.1 31.52,40.72 31.52,43.76 30.48,44.8 R11.1 | 30.96,23.2 30.96,20.4 30.32,19.76 C3.1 | 39.04,52.88 U$4.7_VCC_IO | 40.08,52.88 U$4.8_VCC 40.16,52.88 | 41.04,52.88 U$4.9_V_RESET 41.2,52.8 41.2,49.44 41.68,48.96 C14.1 41.68,48.8 40.64,47.76 40.64,44.56 42.32,42.88 v42.32,40.56 | 48.64,26 50.08,24.56 C7.1 50.88,24.48 50.88,23.44 v51.2,23.12 | 48.64,26 48,26.64 46.48,26.64 IC1.17 | U$1.3 38.64,36.8 40.64,36.8 U$1.4 40.72,36 42.56,34.16 v42.56,34.08 | LED1.A 50.16,58.96 49.04,57.84 49.04,41.2 49.6,40.64 R5.2 49.68,40.56 49.68,38.16 R6.2 49.68,38.08 49.68,35.6 R1.2 49.68,35.44 49.68,34.8 49.52,34.64 | 49.52,34.64 v48.96,34.08 | 48.64,26 49.6,26.96 49.6,34.56 49.52,34.64 | v31.12,23.2 30.96,23.2 | v39.76,23.28 39.84,23.28
  Top 0.61: 40.08,52.88 39.04,52.88 | 41.04,52.88 40.16,52.88
  Top 0.813: 16.48,60.16 16.48,56.13 16.48,54.08
  Bottom 0.254: J1.2 52,3.84 50.72,5.12 43.2,5.12 41.92,3.84 JP3.4 | v48.96,34.08 v42.56,34.08 42.48,34.16 42.32,34.16 v42.32,40.56 | SSDV.3 53.6,23.12 v51.2,23.12 51.12,23.2 39.76,23.2 | 39.76,23.2 v31.12,23.2 31.04,23.28 26.88,23.28 v26.72,23.44 | v39.76,23.28 39.76,23.2

### Text on the board
tPlace: 3V3 | V5V | VBATT | 2MTR | LED | 70CMS | 45808 | www.projectswift.co.uk | Swift Rev.2 | <